# EAGLE design a52-flashcart-v2 (EAGLE 7.0.0)
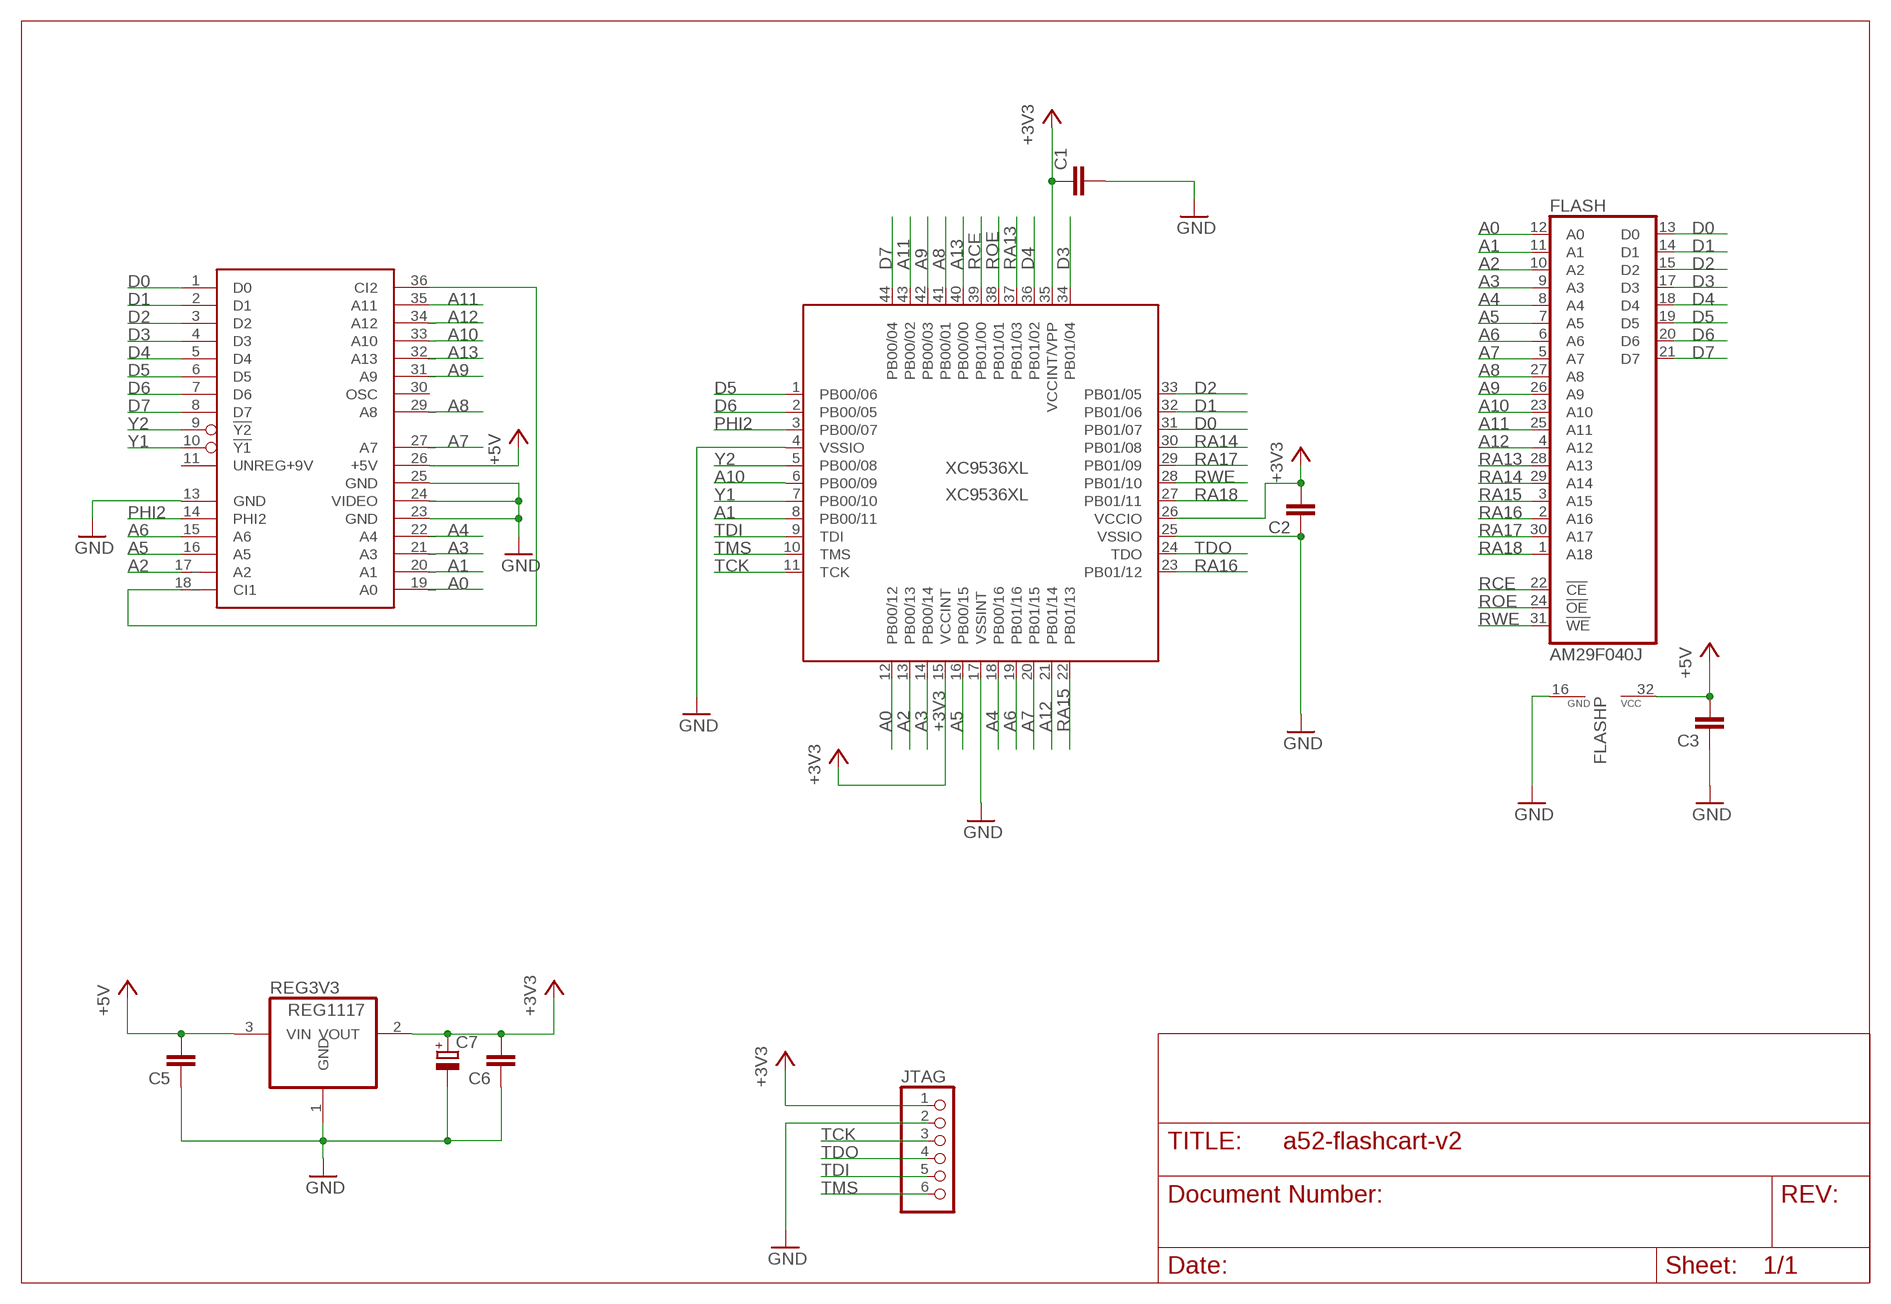
[diagram p0: schematic, sheet 1]

## Parts
C1  C-EUC0603  [C0603]
C2  C-EUC0603  [C0603]
C3  C-EUC0603  [C0603]
C5  C-EUC0603  [C0603]
C6  C-EUC0603  [C0603]
C7  CPOL-EUSMCC  [SMC_C]
FLASH  AM29F040J  [PLCC32R]
JTAG  PINHD-1X6  [1X06]
REG3V3  REG1117  [SOT223]
U$1  ATARI-5200-TS  [ATARI-5200-SMALL-T]
XC9536XL  XC9536XL  XC9536_44VQ  [SQFP-S-10X10-44]

## Nets
+3V3: C1.1 C2.2 C6.2 C7.+ JTAG.1 REG3V3.2(VOUT) XC9536XL.15(VCCINT) XC9536XL.26(VCCIO) XC9536XL.35(VCCINT/VPP)
+5V: C3.2 C5.2 FLASH.32(VCC) REG3V3.3(VIN) U$1.26_(+5V)
A0: FLASH.12(A0) U$1.19_(A0) XC9536XL.12(PB00/12)
A1: FLASH.11(A1) U$1.20_(A1) XC9536XL.8(PB00/11)
A2: FLASH.10(A2) U$1.17_(A2) XC9536XL.13(PB00/13)
A3: FLASH.9(A3) U$1.21_(A3) XC9536XL.14(PB00/14)
A4: FLASH.8(A4) U$1.22_(A4) XC9536XL.18(PB00/16)
A5: FLASH.7(A5) U$1.16(A5) XC9536XL.16(PB00/15)
A6: FLASH.6(A6) U$1.15(A6) XC9536XL.19(PB01/16)
A7: FLASH.5(A7) U$1.27_(A7) XC9536XL.20(PB01/15)
A8: FLASH.27(A8) U$1.29_(A8) XC9536XL.41(PB00/01)
A9: FLASH.26(A9) U$1.31_(A9) XC9536XL.42(PB00/03)
A10: FLASH.23(A10) U$1.33_(A10) XC9536XL.6(PB00/09)
A11: FLASH.25(A11) U$1.35(A11) XC9536XL.43(PB00/02)
A12: FLASH.4(A12) U$1.34_(A12) XC9536XL.21(PB01/14)
A13: U$1.32_(A13) XC9536XL.40(PB00/00)
D0: FLASH.13(D0) U$1.1(D0) XC9536XL.31(PB01/07)
D1: FLASH.14(D1) U$1.2(D1) XC9536XL.32(PB01/06)
D2: FLASH.15(D2) U$1.3(D2) XC9536XL.33(PB01/05)
D3: FLASH.17(D3) U$1.4(D3) XC9536XL.34(PB01/04)
D4: FLASH.18(D4) U$1.5(D4) XC9536XL.36(PB01/02)
D5: FLASH.19(D5) U$1.6(D5) XC9536XL.1(PB00/06)
D6: FLASH.20(D6) U$1.7(D6) XC9536XL.2(PB00/05)
D7: FLASH.21(D7) U$1.8(D7) XC9536XL.44(PB00/04)
GND: C1.2 C2.1 C3.1 C5.1 C6.1 C7.- FLASH.16(GND) JTAG.2 REG3V3.1(GND) U$1.13(GND) U$1.23(GND) U$1.24_(VIDEO) U$1.25(GND) XC9536XL.4(VSSIO) XC9536XL.17(VSSINT) XC9536XL.25(VSSIO)
N$14: U$1.18_(CI1) U$1.36(CI2)
PHI2: U$1.14(PHI2) XC9536XL.3(PB00/07)
RA13: FLASH.28(A13) XC9536XL.37(PB01/03)
RA14: FLASH.29(A14) XC9536XL.30(PB01/08)
RA15: FLASH.3(A15) XC9536XL.22(PB01/13)
RA16: FLASH.2(A16) XC9536XL.23(PB01/12)
RA17: FLASH.30(A17) XC9536XL.29(PB01/09)
RA18: FLASH.1(A18) XC9536XL.27(PB01/11)
RCE: FLASH.22(!CE) XC9536XL.39(PB01/00)
ROE: FLASH.24(!OE) XC9536XL.38(PB01/01)
RWE: FLASH.31(!WE) XC9536XL.28(PB01/10)
TCK: JTAG.3 XC9536XL.11(TCK)
TDI: JTAG.5 XC9536XL.9(TDI)
TDO: JTAG.4 XC9536XL.24(TDO)
TMS: JTAG.6 XC9536XL.10(TMS)
Y1: U$1.10(!Y1) XC9536XL.7(PB00/10)
Y2: U$1.9(!Y2) XC9536XL.5(PB00/08)
Unconnected: U$1.11(UNREG+9V) U$1.30(OSC)

## Library data of the parts
C1-C3 C5 C6 = resistor:C-EU: CAPACITOR, European symbol
C7 = resistor:CPOL-EU: POLARIZED CAPACITOR, European symbol
FLASH = am29-memory:AM29F040J: 4-Megabit FLASH MEMORY (512 K x 8 bit) 5 V-only
JTAG = adafruit:PINHD-1X6: PIN HEADER
REG3V3 = burr-brown:REG1117: 800mA and 1A Low Dropout (LDO) Positive Regulator 1.8V, 2.5V, 2.85V, 3.3V, 5V, and Adj; MPN: REG1117; OC_FARNELL: 1097566; OC_NEWARK: 14P6981
U$1 = a52-cartridge:ATARI-5200-T: Extended ROM Cart Edge Connector OSC and VIDEO signals was used in VCS T Interface for 5200 Systems
XC9536XL = xilinx-xc9:XC9536_44VQ: xc9536_pc44 XC9500 In-System Programmable CPLD Family Auto generated by make-symbol-device-package-bsdl.ulp Rev. 34 Source: xc9536_vq44.bsd; MPN: XC9536-15VQG44C; OC_FARNELL: 1193227; OC_NEWARK: 98K3377

## Board
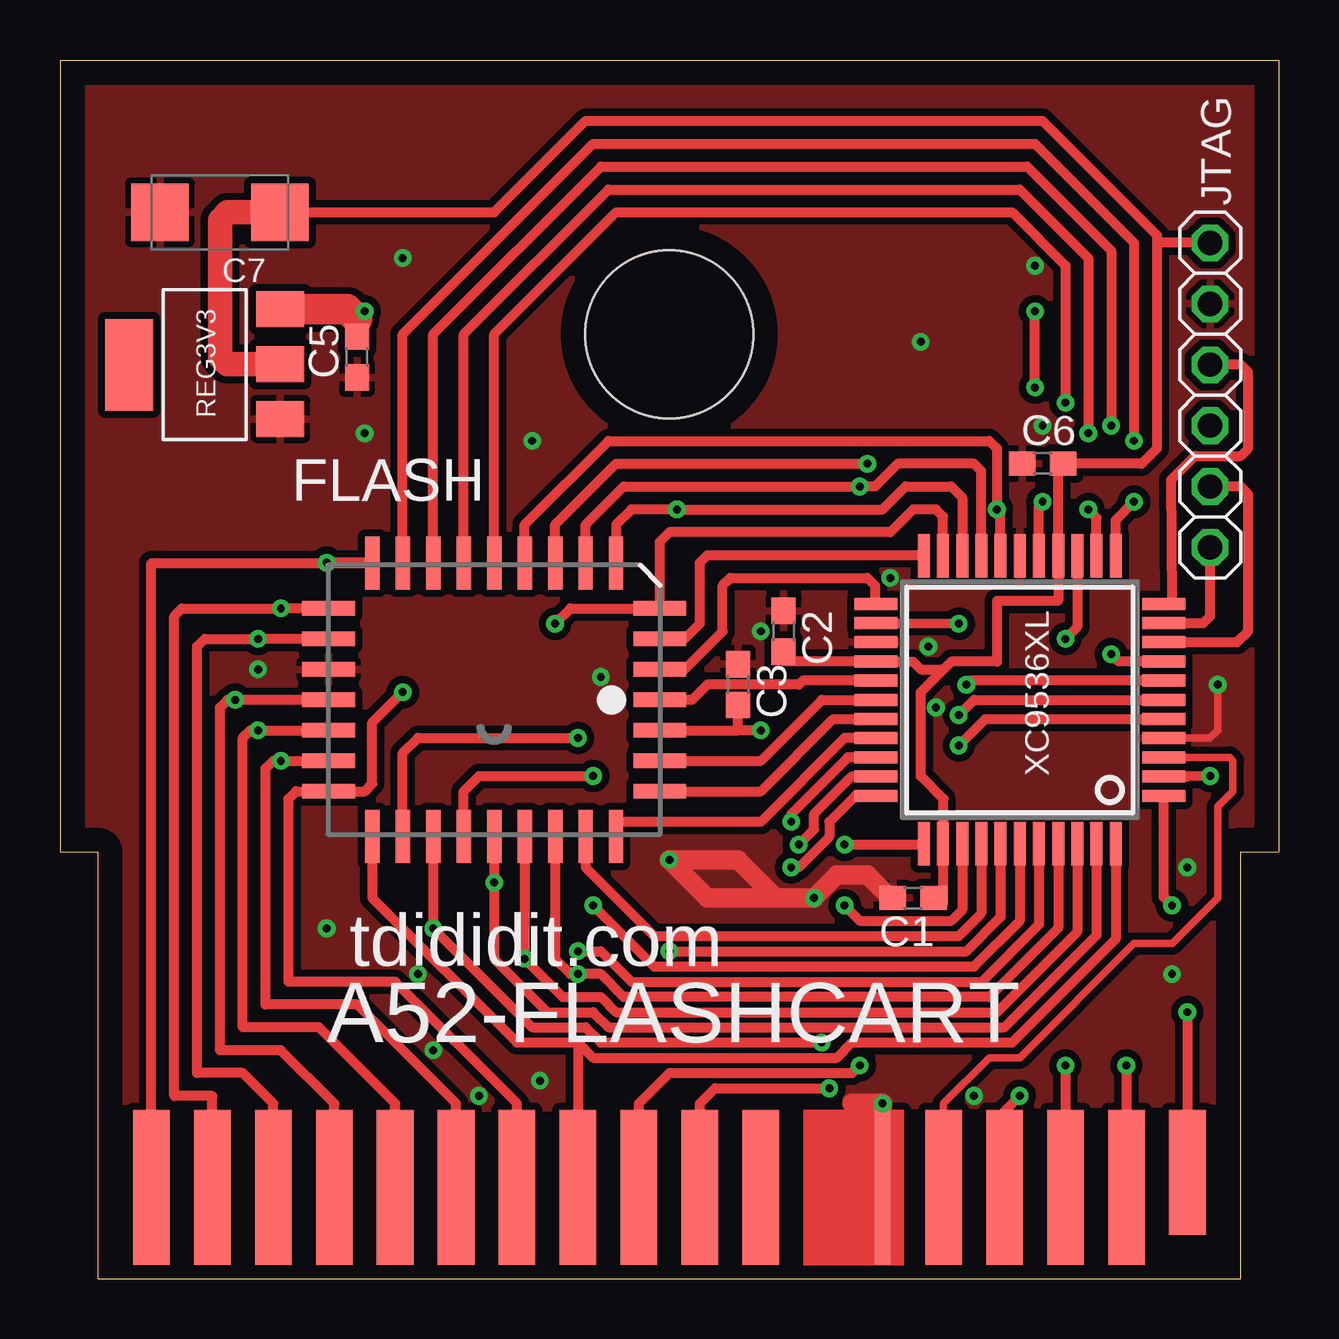
[diagram p1: board, top side]
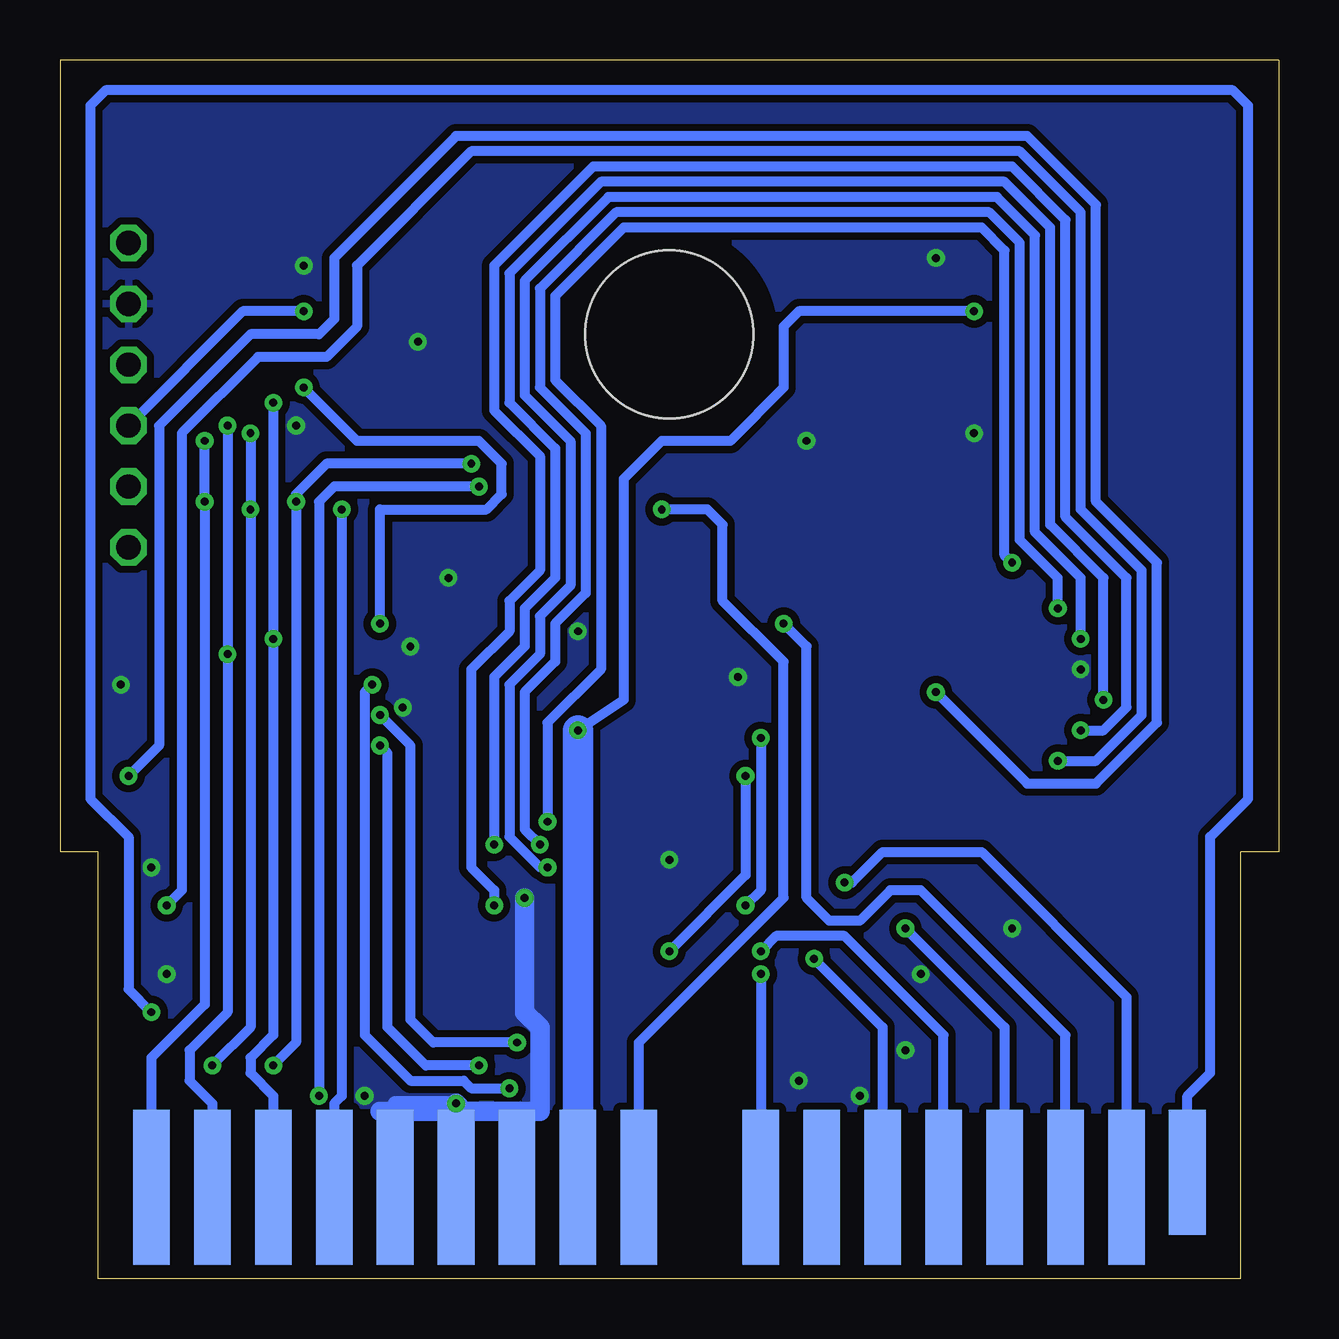
[diagram p2: board, bottom side, seen from below]

Size 50.8 x 50.8 mm. Coordinates in mm from the lower left corner, seen from the top.
Copper layers (1*16): Top 0.035mm / dielectric 1.5mm / Bottom 0.035mm
Design rules "default": minimum track width 10mil, minimum drill 24mil, track to track 8mil, track to pad 8mil, pad to pad 8mil, via to via 8mil, smd to smd 8mil, copper to edge 40mil, drill to drill 8mil, minimum pad ring 10mil, minimum via ring 8mil, stop-mask expansion 4mil, vias tented up to drill 0mil, thermal gap 10mil

### Footprints (pad centres in the part's own frame; a part is rotated, then mirrored left to right if it is on the bottom)
C0603 = smd 1.1 x 1: 1 -0.85,0; 2 0.85,0
SMC_C = smd 2.4 x 2.4: + -2.5,0; - 2.5,0
PLCC32R = smd 0.6 x 2.2: 1 0,6.9; 2 -1.27,6.9; 3 -2.54,6.9; 4 -3.81,6.9; 14 -3.81,-6.9; 15 -2.54,-6.9; 16 -1.27,-6.9; 17 0,-6.9; 18 1.27,-6.9; 19 2.54,-6.9; 20 3.81,-6.9; 30 3.81,6.9; 31 2.54,6.9; 32 1.27,6.9 | smd 2.2 x 0.6: 5 -5.7,5.08; 6 -5.7,3.81; 7 -5.7,2.54; 8 -5.7,1.27; 9 -5.7,0; 10 -5.7,-1.27; 11 -5.7,-2.54; 12 -5.7,-3.81; 13 -5.7,-5.08; 21 5.7,-5.08; 22 5.7,-3.81; 23 5.7,-2.54; 24 5.7,-1.27; 25 5.7,0; 26 5.7,1.27; 27 5.7,2.54; 28 5.7,3.81; 29 5.7,5.08
1X06 = drill 1.016 octagon: 1 -6.35,0; 2 -3.81,0; 3 -1.27,0; 4 1.27,0; 5 3.81,0; 6 6.35,0
SOT223 = smd 1.499 x 2.007: 1 -2.261,-3.15; 2 0.025,-3.15; 3 2.311,-3.15 | smd 3.81 x 2.007: 4 0,3.15
ATARI-5200-SMALL-T = smd 1.524 x 6.477: 1 -21.59,3.81; 2 -19.05,3.81; 3 -16.51,3.81; 4 -13.97,3.81; 5 -11.43,3.81; 6 -8.89,3.81; 7 -6.35,3.81; 8 -3.81,3.81; 9 -1.27,3.81; 10 1.27,3.81; 11 3.81,3.81; 14 11.43,3.81; 15 13.97,3.81; 16 16.51,3.81; 17_ 19.05,3.81 | smd 0.648 x 6.477: 13 8.89,3.81 | smd 1.524 x 5.207: 18_ 21.59,4.445 | smd 1.524 x 6.477 bottom: 19_ 21.59,3.81; 20_ 19.05,3.81; 21_ 16.51,3.81; 22_ 13.97,3.81; 23 11.43,3.81; 24_ 8.89,3.81; 25 6.35,3.81; 26_ 3.81,3.81; 27_ 1.27,3.81; 29_ -3.81,3.81; 30 -6.35,3.81; 31_ -8.89,3.81; 32_ -11.43,3.81; 33_ -13.97,3.81; 34_ -16.51,3.81; 35 -19.05,3.81 | smd 1.524 x 5.207 bottom: 36 -21.59,4.445 | hole 7: 0,39.37
SQFP-S-10X10-44 = smd 0.5 x 1.8: 1 -4,-6; 2 -3.2,-6; 3 -2.4,-6; 4 -1.6,-6; 5 -0.8,-6; 6 0,-6; 7 0.8,-6; 8 1.6,-6; 9 2.4,-6; 10 3.2,-6; 11 4,-6; 23 4,6; 24 3.2,6; 25 2.4,6; 26 1.6,6; 27 0.8,6; 28 0,6; 29 -0.8,6; 30 -1.6,6; 31 -2.4,6; 32 -3.2,6; 33 -4,6 | smd 1.8 x 0.5: 12 6,-4; 13 6,-3.2; 14 6,-2.4; 15 6,-1.6; 16 6,-0.8; 17 6,0; 18 6,0.8; 19 6,1.6; 20 6,2.4; 21 6,3.2; 22 6,4; 34 -6,4; 35 -6,3.2; 36 -6,2.4; 37 -6,1.6; 38 -6,0.8; 39 -6,0; 40 -6,-0.8; 41 -6,-1.6; 42 -6,-2.4; 43 -6,-3.2; 44 -6,-4

### Placement (x,y rotation side)
C1  35.56,15.87 180 top
C2  30.16,26.99 270 top
C3  28.26,24.77 270 top
C5  12.38,38.42 90 top
C6  40.96,33.97 0 top
C7  6.67,44.45 180 top
FLASH  18.1,24.13 270 top
JTAG  47.94,36.83 270 top
REG3V3  6.03,38.1 90 top
U$1  25.4,0 0 top
XC9536XL  40.01,24.13 90 top

### Tracks (layer width: path | path; a pad name or v marks a point on that pad's centre or on a via)
+3V3
  Top 0.406: C2.2 30.16,25.73 XC9536XL.26 34.02,25.72 35.56,25.72 35.88,25.4 36.78,25.4 36.81,25.37 | C1.1 36.81,15.64 XC9536XL.35 36.83,20 35.88,20.96 35.88,24.45 36.81,25.37 | JTAG.1 45.72,43.18 | 45.72,43.18 45.72,34.61 45.09,33.97 C6.2 41.6,33.54 XC9536XL.15 41.6,28.27 41.59,28.26 39.05,28.26 39.05,25.72 37.15,25.72 36.81,25.37 | 8.89,44.45 18.1,44.45 21.91,48.26 40.96,48.26 45.72,43.5 45.72,43.18
  Top 1.016: REG3V3.2 6.96,38.13 6.67,38.42 6.67,44.13 6.99,44.45 8.89,44.45 C7.+
+5V  (via drill 0.33)
  Top 0.406: FLASH.32 28.26,22.86 | v29.21,22.86 28.26,22.86 | 28.26,22.86 C3.2 | C5.2 12.38,40 v12.7,40.32
  Top 1.27: REG3V3.3 11.98,40.41 12.38,40
  Bottom 0.406: v12.7,40.32 20,40.32 20.64,39.69 20.64,37.15 22.86,34.92 25.72,34.92 27.31,33.34 27.31,24.13 v29.21,22.86
  Bottom 1.27: U$1.26_ v29.21,22.86
A0  (via drill 0.33)
  Top 0.406: FLASH.12 14.29,39.37 22.22,47.31 40.64,47.31 44.77,43.18 v44.77,34.92 | XC9536XL.12 44.01,31.62 v44.77,32.39
  Bottom 0.406: U$1.19_ 46.99,9.21 44.77,11.43 v44.77,32.39 v44.77,34.92
A1  (via drill 0.33)
  Top 0.406: FLASH.11 15.56,39.37 22.54,46.35 40.32,46.35 43.81,42.86 v43.81,35.56 | XC9536XL.8 44.12,25.73 v43.81,26.03
  Bottom 0.406: v43.81,35.56 v43.81,26.03 43.81,11.11 45.4,9.52 45.4,8.25 44.45,7.3 U$1.20_
A2  (via drill 0.33)
  Top 0.406: FLASH.10 16.83,39.37 22.86,45.4 40.01,45.4 42.86,42.54 v42.86,35.24 | v44.45,8.89 U$1.17_ | XC9536XL.13 43.2,31.72 v42.86,32.07
  Bottom 0.406: v42.86,35.24 v42.86,32.07 42.86,10.48 v44.45,8.89
A3  (via drill 0.33)
  Top 0.406: FLASH.9 18.1,39.37 23.18,44.45 39.69,44.45 41.91,42.23 v41.91,36.51 | XC9536XL.14 42.41,27.17 v41.91,26.67
  Bottom 0.406: v41.91,36.51 v41.91,26.67 41.91,10.16 42.86,9.21 42.86,8.57 41.91,7.62 U$1.21_
A4  (via drill 0.33)
  Top 0.406: FLASH.8 19.37,31.43 22.86,34.92 38.74,34.92 39.05,34.61 v39.05,32.07 39.2,31.92 XC9536XL.18
  Bottom 0.406: v39.05,32.07 39.05,7.62 39.37,7.3 U$1.22_
A5  (via drill 0.33)
  Top 0.406: FLASH.7 20.64,31.43 23.18,33.97 v33.66,33.97 | v41.91,8.89 U$1.16 | XC9536XL.16 40.81,32.23 v40.96,32.39
  Bottom 0.406: v33.66,33.97 39.69,33.97 40.96,32.7 v40.96,32.39 40.96,9.84 v41.91,8.89
A6  (via drill 0.33)
  Top 0.406: FLASH.6 21.91,31.43 23.5,33.02 v33.34,33.02 33.97,33.02 34.92,33.97 38.1,33.97 38.41,33.67 XC9536XL.19 | v40.01,7.62 39.37,6.99 U$1.15
  Bottom 0.406: v33.34,33.02 39.37,33.02 40.01,32.39 v40.01,7.62
A7  (via drill 0.33)
  Top 0.406: FLASH.5 23.18,31.43 23.81,32.07 v25.72,32.07 34.29,32.07 35.24,33.02 37.15,33.02 37.6,32.56 XC9536XL.20
  Bottom 0.406: U$1.27_ 26.67,9.84 20.64,15.87 20.64,25.72 23.18,28.26 23.18,31.43 23.81,32.07 v25.72,32.07
A8  (via drill 0.33)
  Top 0.406: FLASH.27 20.64,13.33 21.27,12.7 v21.59,12.7 22.54,12.7 23.5,11.75 38.74,11.75 41.6,14.62 XC9536XL.41
  Bottom 0.406: v21.59,12.7 U$1.29_
A9  (via drill 0.33)
  Top 0.406: FLASH.26 v19.37,13.33 20.95,11.75 22.54,11.75 23.18,11.11 39.05,11.11 42.41,14.47 XC9536XL.42
  Bottom 0.406: v19.37,13.33 16.51,10.48 U$1.31_
A10  (via drill 0.33)
  Top 0.406: FLASH.23 v15.56,14.6 19.68,10.48 21.91,10.48 22.54,9.84 v31.75,9.84 | v37.46,23.49 38.1,24.13 XC9536XL.6
  Bottom 0.406: v15.56,14.6 11.43,10.48 U$1.33_ | v31.75,9.84 35.24,9.84 36.2,10.8 36.2,22.23 v37.46,23.49
A11  (via drill 0.33)
  Top 0.406: v18.1,16.51 FLASH.25 18.1,13.33 20.32,11.11 22.22,11.11 22.86,10.48 39.37,10.48 43.2,14.31 XC9536XL.43
  Bottom 0.406: v18.1,16.51 17.78,16.51 16.51,17.78 12.38,17.78 6.35,11.75 U$1.35
A12  (via drill 0.33)
  Top 0.406: v20.64,27.3 21.27,27.94 FLASH.4 25,30.71 25.4,31.12 34.61,31.12 35.56,32.07 36.51,32.07 36.81,31.78 XC9536XL.21
  Bottom 0.406: U$1.34_ 8.89,10.16 14.92,16.19 16.19,16.19 17.46,14.92 18.73,14.92 19.68,15.87 19.68,26.35 v20.64,27.3
A13  (via drill 0.33)
  Top 0.406: v21.59,13.65 22.54,13.65 23.81,12.38 38.42,12.38 40.81,14.77 XC9536XL.40
  Bottom 0.406: U$1.32_ 13.97,10.16 18.1,14.29 20.95,14.29 v21.59,13.65
D0  (via drill 0.33)
  Top 0.406: U$1.1 3.81,29.83 FLASH.13 13,29.85 v11.11,29.85 | XC9536XL.31 32.84,21.73 30.48,19.37 v30.48,19.05
  Bottom 0.406: v11.11,29.85 11.43,30.16 11.43,42.86 12.38,43.82 27.31,43.82 30.16,40.96 30.16,37.46 28.26,35.56 28.26,25.4 30.48,23.18 v30.48,19.05
D1  (via drill 0.33)
  Top 0.406: U$1.2 6.35,7.62 4.76,7.62 4.76,27.62 5.08,27.94 v9.21,27.94 FLASH.14 | v30.8,18.1 31.43,18.73 31.43,19.37 32.99,20.93 XC9536XL.32
  Bottom 0.406: v9.21,27.94 9.21,29.21 10.8,30.8 10.8,43.18 12.07,44.45 27.62,44.45 30.8,41.28 30.8,37.15 28.89,35.24 28.89,28.57 30.16,27.3 30.16,25.72 31.43,24.45 31.43,18.73 v30.8,18.1
D2  (via drill 0.33)
  Top 0.406: U$1.3 8.89,7.3 7.62,8.57 5.72,8.57 5.72,26.35 6.03,26.67 v8.25,26.67 FLASH.15 | v30.48,17.14 30.8,17.14 32.07,18.42 32.07,19.05 33.15,20.13 XC9536XL.33
  Bottom 0.406: v8.25,26.67 8.25,29.21 10.16,31.12 10.16,43.5 11.75,45.09 27.94,45.09 31.43,41.59 31.43,36.83 29.53,34.92 29.53,28.89 30.8,27.62 30.8,26.03 32.07,24.76 32.07,18.42 30.8,17.14 v30.48,17.14
D3  (via drill 0.33)
  Top 0.406: U$1.4 11.43,7.3 9.21,9.52 6.67,9.52 6.67,23.81 6.99,24.13 v7.3,24.13 FLASH.17 | v32.7,18.1 35.97,18.1 XC9536XL.34
  Bottom 0.406: v7.3,24.13 7.3,29.21 9.52,31.43 9.52,43.82 11.43,45.72 28.26,45.72 32.07,41.91 32.07,36.51 30.16,34.61 30.16,29.21 31.43,27.94 31.43,26.35 32.7,25.08 v32.7,18.1
D4  (via drill 0.33)
  Top 0.406: U$1.5 13.97,7.3 10.8,10.48 7.62,10.48 7.62,22.54 7.94,22.86 v8.25,22.86 FLASH.18 | v32.7,15.56 33.34,14.92 37.15,14.92 37.6,15.38 XC9536XL.36
  Bottom 0.406: v8.25,22.86 7.3,22.86 6.35,23.81 6.35,29.21 8.89,31.75 8.89,44.13 11.11,46.35 28.57,46.35 32.7,42.23 32.7,36.2 30.8,34.29 30.8,29.53 32.07,28.26 32.07,26.99 33.66,25.4 33.66,17.14 32.7,16.19 v32.7,15.56
D5  (via drill 0.33)
  Top 0.406: U$1.6 16.51,7.3 12.38,11.43 8.57,11.43 8.57,21.27 8.89,21.59 v9.21,21.59 FLASH.19 | v46.35,15.56 46.01,15.91 XC9536XL.1
  Bottom 0.406: v9.21,21.59 7.62,21.59 5.72,23.49 5.72,29.53 8.25,32.07 8.25,44.45 10.8,46.99 33.66,46.99 38.42,42.23 38.42,39.69 39.69,38.42 42.55,38.42 45.72,35.24 45.72,16.19 v46.35,15.56
D6  (via drill 0.33)
  Top 0.406: U$1.7 19.05,7.3 13.97,12.38 9.52,12.38 9.52,20 9.84,20.32 FLASH.20 12.7,20.32 13.02,20.64 13.02,23.18 v14.29,24.45 | v47.94,20.96 46.96,20.93 XC9536XL.2
  Bottom 0.406: v14.29,24.45 10.48,20.64 7.62,20.64 5.08,23.18 5.08,29.85 7.62,32.39 7.62,44.77 10.48,47.63 34.29,47.63 39.37,42.54 39.37,40 40.01,39.37 42.86,39.37 46.67,35.56 46.67,22.23 v47.94,20.96
D7
  Top 0.406: FLASH.21 13.02,15.87 19.05,9.84 21.59,9.84 | 21.59,9.84 U$1.8 | 21.59,9.84 22.22,9.21 32.38,9.21 33.02,9.84 39.69,9.84 44.01,14.16 XC9536XL.44
GND  (via drill 0.33)
  Top 0.305: XC9536XL.4 47.93,22.53 48.26,22.86 v48.26,24.76
  Top 0.813: 33.02,7.3 v34.29,7.3 U$1.24_ | C1.2 34.61,15.87 33.66,16.83 32.38,16.83 v31.43,15.87 29.84,15.87 | 29.84,15.87 26.99,15.87 v25.4,17.46 28.26,17.46 29.84,15.87
  Bottom 0.305: 33.66,6.99 33.97,7.3 v34.29,7.3
  Bottom 0.61: U$1.23 36.83,7.3 v34.29,7.3 | U$1.24_ 34.29,6.99 33.97,6.99 | 31.75,6.99 U$1.25
  Bottom 0.813: 33.97,6.99 v34.29,7.3 U$1.24_ | 33.97,6.99 33.66,6.99 31.75,6.99 30.8,6.99 30.8,10.48 31.43,11.11 v31.43,15.87 | 37.46,6.99 33.97,6.99
  other vias: 8.25,25.4 40.96,35.56 22.54,25.08 14.29,42.54 40.64,42.23 35.88,39.05 36.51,23.81 34.61,29.21 29.21,26.99 36.2,26.35 12.7,35.24 46.99,17.14 46.35,12.7 11.11,14.6 19.68,34.92 38.1,7.62 20,8.25 17.46,7.62 15.56,9.52 14.92,12.7
  pour Bottom (isolate 0.305): 51.12,50.8 0,50.8 -0.32,6.99 51.12,7.3 51.44,50.48
  pour Top (isolate 0.305): 51.12,50.8 0,50.8 -0.32,6.99 51.12,7.3
N$14  (via drill 0.33)
  Top 0.406: v46.99,11.11 U$1.18_
  Bottom 0.406: U$1.36 3.81,7.62 2.86,8.57 2.86,18.42 1.27,20 1.27,48.89 1.9,49.53 48.89,49.53 49.53,48.89 49.53,20 47.94,18.42 47.94,12.07 v46.99,11.11
PHI2
  Top 0.305: U$1.14 36.83,7.3 38.74,9.21 40.01,9.21 44.77,13.97 46.35,13.97 48.26,15.87 48.26,19.69 48.89,20.32 48.89,21.59 48.76,21.73 XC9536XL.3
RA13
  Top 0.406: FLASH.28 21.91,17.14 24.77,14.29 37.46,14.29 38.41,15.23 XC9536XL.37
RA14
  Top 0.406: XC9536XL.30 33.99,22.54 32.7,22.54 29.21,19.05 23.18,19.05 FLASH.29
RA15
  Top 0.406: FLASH.3 26.04,26.67 26.67,27.3 26.67,29.85 26.99,30.16 35.97,30.16 XC9536XL.22
RA16
  Top 0.406: FLASH.2 26.04,25.4 27.62,26.99 27.62,28.89 27.94,29.21 33.66,29.21 33.97,28.89 33.97,28.16 XC9536XL.23
RA17
  Top 0.406: FLASH.30 29.21,20.32 32.22,23.33 XC9536XL.29
RA18
  Top 0.406: XC9536XL.27 30.96,24.93 30.8,24.76 26.99,24.76 26.35,24.13 FLASH.1
RCE  (via drill 0.33)
  Top 0.406: FLASH.22 14.29,21.91 14.92,22.54 v21.59,22.54 | v22.22,15.56 24.77,13.02 38.1,13.02 40.01,14.92 XC9536XL.39
  Bottom 0.406: v21.59,22.54 21.59,16.19 v22.22,15.56
ROE  (via drill 0.33)
  Top 0.406: FLASH.24 16.83,20.32 17.46,20.96 v22.22,20.96 | v25.4,13.65 37.78,13.65 39.2,15.08 XC9536XL.38
  Bottom 0.406: v22.22,20.96 22.22,16.83 v25.4,13.65
RWE
  Top 0.406: FLASH.31 29.21,21.59 31.75,24.13 XC9536XL.28
TCK
  Top 0.406: XC9536XL.11 46.35,28.13 46.35,28.26 46.32,33.31 47.31,34.29 49.21,34.29 49.53,34.61 49.53,37.78 49.21,38.1 JTAG.3
TDI
  Top 0.406: XC9536XL.9 49.07,26.53 49.53,26.99 49.53,32.7 49.21,33.02 JTAG.5
TDO  (via drill 0.33)
  Top 0.406: XC9536XL.24 34.58,27.33 v37.46,27.3 | v40.64,37.15 v40.64,40.32
  Bottom 0.406: v37.46,27.3 37.46,32.07 33.02,32.07 32.38,32.7 32.38,33.97 33.34,34.92 38.42,34.92 v40.64,37.15 | v40.64,40.32 43.18,40.32 JTAG.4
TMS
  Top 0.406: XC9536XL.10 47.65,27.33 47.94,27.62 JTAG.6
Y1  (via drill 0.33)
  Top 0.406: U$1.10 26.67,7.3 27.31,7.94 v32.07,7.94 | XC9536XL.7 37.95,24.93 v37.78,24.76
  Bottom 0.406: v37.78,24.76 38.1,24.45 38.1,10.16 36.2,8.25 33.97,8.25 33.66,7.94 v32.07,7.94
Y2  (via drill 0.33)
  Top 0.406: U$1.9 24.13,7.3 25.4,8.57 33.02,8.57 v33.34,8.89 | v37.46,22.23 38.57,23.33 XC9536XL.5
  Bottom 0.406: v33.34,8.89 35.56,8.89 37.15,10.48 37.15,21.91 v37.46,22.23

### Text on the board
tPlace: tdididit.com | A52-FLASHCART